# Altium schematic sheet PWM_Isolator.SchDoc
size A; SheetNumber: 4; SheetTotal: 6
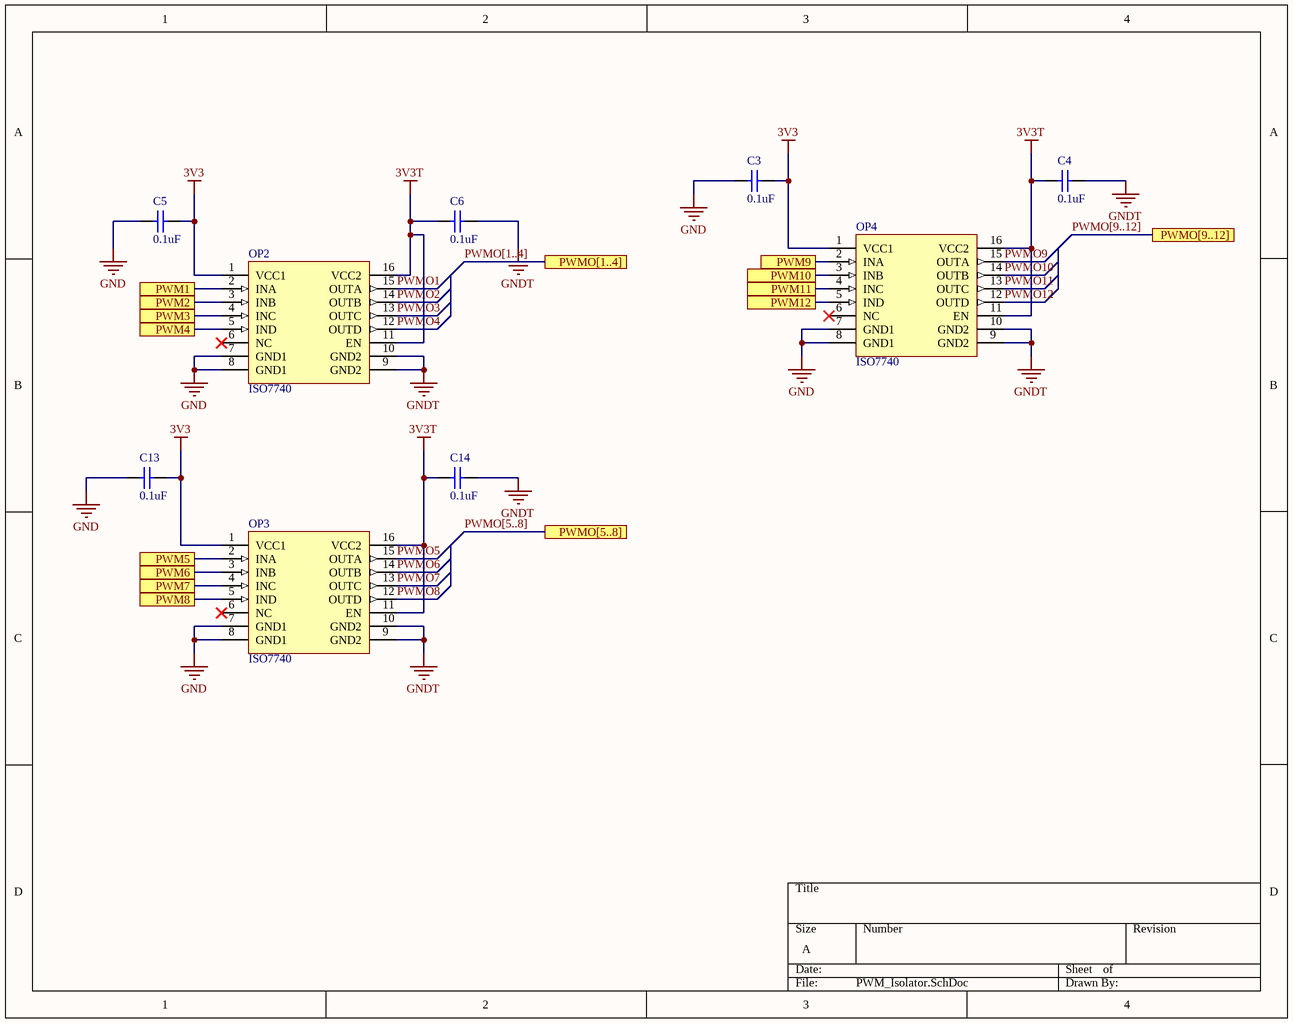
[diagram p0: PWM_Isolator.SchDoc]

## Parts
C3  0.1uF  [CAPC1608X97X38NL12T08]
C4  0.1uF  [CAPC1608X97X38NL12T08]
C5  0.1uF  [CAPC1608X97X38NL12T08]
C6  0.1uF  [CAPC1608X97X38NL12T08]
C13  0.1uF  [CAPC1608X97X38NL12T08]
C14  0.1uF  [CAPC1608X97X38NL12T08]
OP2  ISO7740  [DBQ0016A_M]
OP3  ISO7740  [DBQ0016A_M]
OP4  ISO7740  [DBQ0016A_M]

## Ports
PWM1, PWM2, PWM3, PWM4, PWM5, PWM6, PWM7, PWM8, PWM9, PWM10, PWM11, PWM12, PWMO[1..4], PWMO[5..8], PWMO[9..12]

## Nets
3V3: C3.2 C5.2 C13.2 OP2.1(VCC1) OP3.1(VCC1) OP4.1(VCC1)
3V3T: C4.1 C6.1 C14.1 OP2.11(EN) OP2.16(VCC2) OP3.11(EN) OP3.16(VCC2) OP4.11(EN) OP4.16(VCC2)
GND: C3.1 C5.1 C13.1 OP2.7(GND1) OP2.8(GND1) OP3.7(GND1) OP3.8(GND1) OP4.7(GND1) OP4.8(GND1)
GNDT: C4.2 C6.2 C14.2 OP2.9(GND2) OP2.10(GND2) OP3.9(GND2) OP3.10(GND2) OP4.9(GND2) OP4.10(GND2)
PWM1: OP2.2(INA) ; port PWM1
PWM2: OP2.3(INB) ; port PWM2
PWM3: OP2.4(INC) ; port PWM3
PWM4: OP2.5(IND) ; port PWM4
PWM5: OP3.2(INA) ; port PWM5
PWM6: OP3.3(INB) ; port PWM6
PWM7: OP3.4(INC) ; port PWM7
PWM8: OP3.5(IND) ; port PWM8
PWM9: OP4.2(INA) ; port PWM9
PWM10: OP4.3(INB) ; port PWM10
PWM11: OP4.4(INC) ; port PWM11
PWM12: OP4.5(IND) ; port PWM12
PWMO1: OP2.15(OUTA)
PWMO2: OP2.14(OUTB)
PWMO3: OP2.13(OUTC)
PWMO4: OP2.12(OUTD)
PWMO5: OP3.15(OUTA)
PWMO6: OP3.14(OUTB)
PWMO7: OP3.13(OUTC)
PWMO8: OP3.12(OUTD)
PWMO9: OP4.15(OUTA)
PWMO10: OP4.14(OUTB)
PWMO11: OP4.13(OUTC)
PWMO12: OP4.12(OUTD)

Not connected (* = marked no-connect by the designer): OP2 6(NC)*; OP3 6(NC)*; OP4 6(NC)*

## Buses and harness runs
bus PWMO[1..4] = port PWMO[1..4]
bus PWMO[5..8] = port PWMO[5..8]
bus PWMO[9..12] = port PWMO[9..12]

## Library data of the parts
C3-C6 C13 C14 = VJ0603Y104KXXAC: CAP CER 0.1UF 25V X7R 0603; Manufacturer: Vitramon; Part Number: VJ0603Y-104KXXAC; Supplier 1: Digi-Key; Supplier Part Number 1: 720-1378-1-ND
OP2-OP4 = ISO7740DBQR: General Purpose Digital Isolator 3000Vrms 4 Channel 100Mbps 85kV/µs CMTI 16-SSOP (0.154", 3.90mm Width); pin to pad: 2>3 3>4 4>5 5>6 6>7 7>8 8>2 10>15 11>10 12>11 13>12 14>13 15>14; Supplier 1: Digi-Key; Supplier Part Number 1: 296-48138-1-ND